# Altium schematic sheet 1_Power and sensors.schdoc
size 307 x 218 mm; Symbol: Sheet-Symbol_A4; Device: Sheet-Symbol_A4; Company: 嘉立创EDA; Drawed: Fukui (Daniel) Yang; Version: V1.0; Page Size: A4; @Project Name: OptoGrid_V0.05; @Page Count: 1; @Update Date: 2025-09-04; @Create Date: 2025-07-05; @Schematic Name: OptoGrid_Battery_V0.05; @Page No: 1; @Page Name: Power and sensors; Title Block Position: 3; Width: 1170; Height: 825; Region Start: 1; X Region Count: 6; Y Region Count: 4; Blade Width: 10; @Board Name: OptoGrid_Battery_V0.05; @Create Time: 17:39:36; @Update Time: 09:45:07
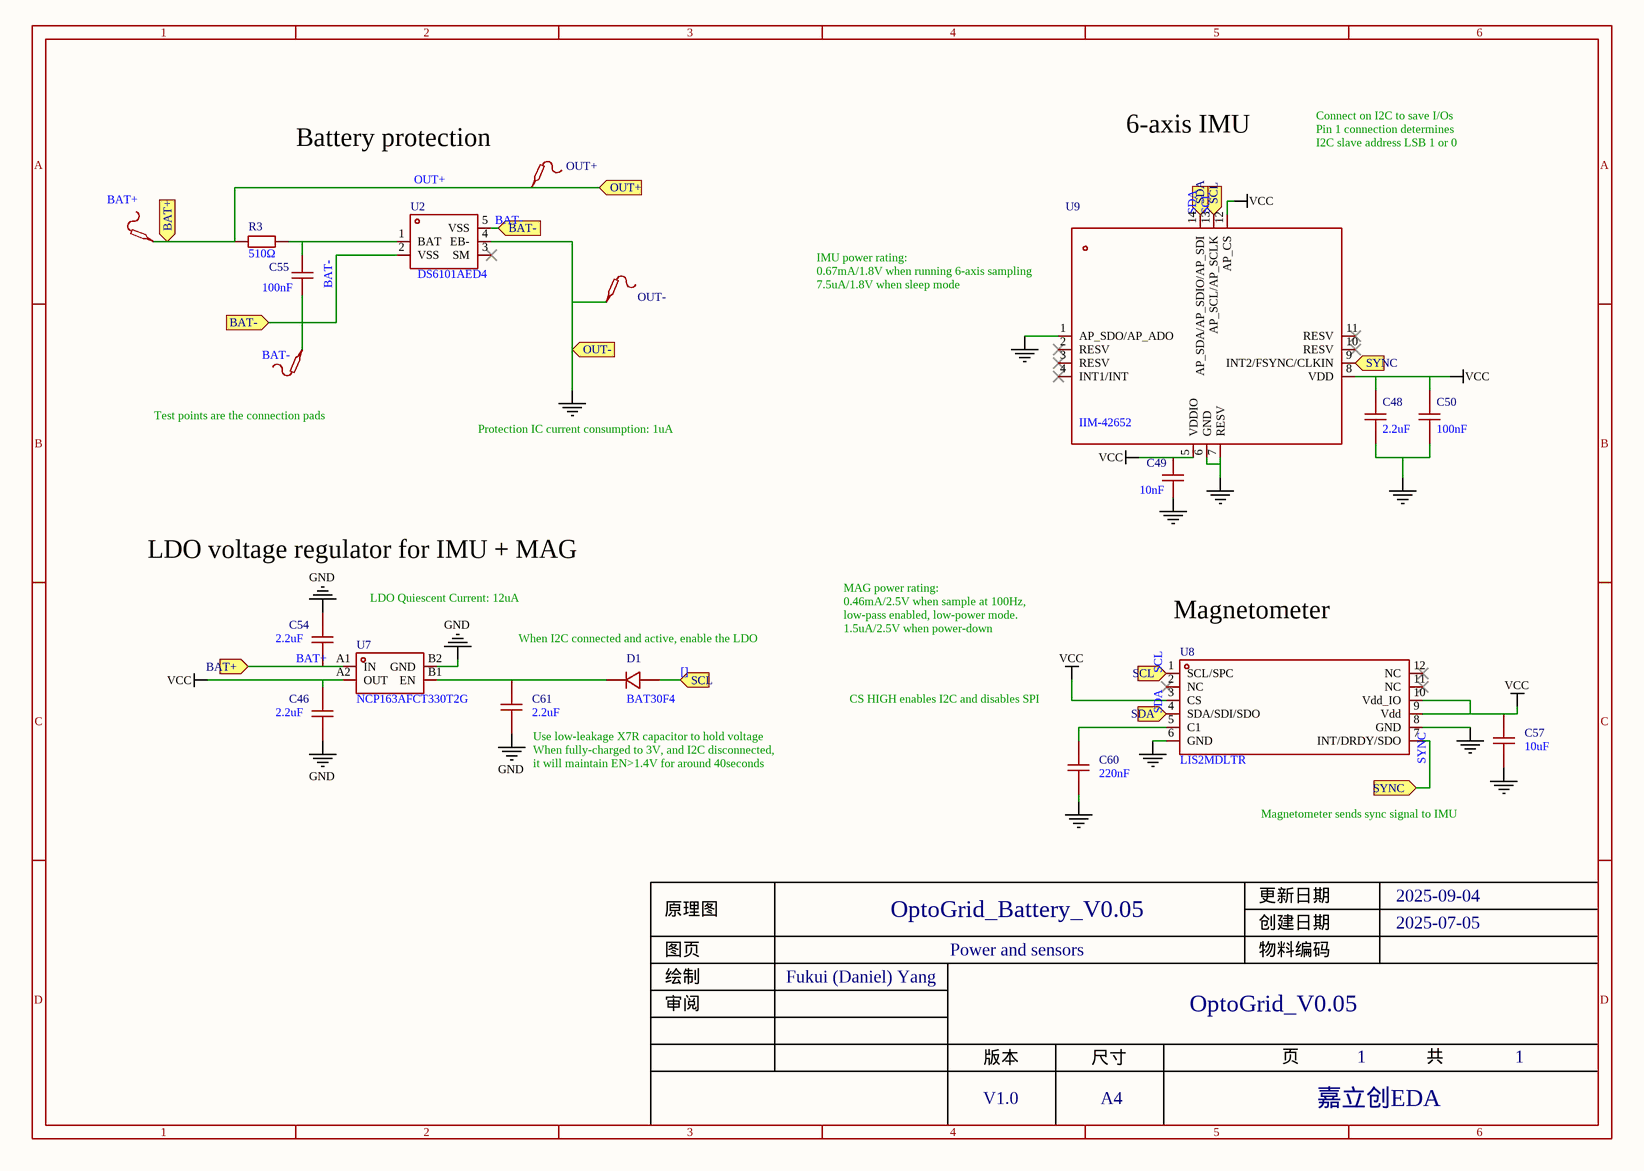
[diagram p0: 1_Power and sensors.schdoc]

## Parts
BAT+  (no value)  [Test-Point-0.5mm]
BAT-  (no value)  [Test-Point-0.5mm]
C46  2.2uF  [C0201]
C48  2.2uF  [C0201]
C49  10nF  [C0201]
C50  100nF  [C0201]
C54  2.2uF  [C0201]
C55  100nF  [C0201]
C57  10uF  [C0402]
C60  220nF  [C0201]
C61  2.2uF  [C0402]
D1  BAT30F4  [DFN0603-D_L0.6-W0.3-P0.34-RD]
OUT+  (no value)  [Test-Point-0.5mm]
OUT-  (no value)  [Test-Point-0.5mm]
R3  510Ω  [R0201]
U2  DS6101AED4  [DFN-4_L1.0-W1.0-P0.65-BL-EP]
U7  NCP163AFCT330T2G  [WLCSP-4_L0.6-W0.6-P0.35-R2-C2-TL]
U8  LIS2MDLTR  [LGA-12_L2.0-W2.0-P0.50-BL]
U9  IIM-42652  [LGA-14_L3.0-W2.5-P0.50-TL]

## Ports
BAT+ (in), BAT- (in), OUT+ (in), OUT- (in), SCL (in), SDA (in), SYNC (in)

## Nets
GND: C46.1 C48.1 C49.1 C50.1 C54.2 C57.1 C60.1 C61.1 OUT-.1 U2.4(EB-) U7.B2(GND) U8.6(GND) U8.8(GND) U9.1(AP_SDO/AP_ADO) U9.6(GND) U9.7(RESV) ; port OUT-
VCC: C46.2 C48.2 C49.2 C50.2 C57.2 U7.A2(OUT) U8.3(CS) U8.9(Vdd) U8.10(Vdd_IO) U9.5(VDDIO) U9.8(VDD) U9.12(AP_CS)
[]: D1.2 U8.1(SCL/SPC) U9.13(AP_SCL/AP_SCLK) ; port SCL  [also labelled SCL]
BAT+: BAT+.1 C54.1 OUT+.1 R3.1 U7.A1(IN) ; port OUT+, port BAT+  [also labelled OUT+]
BAT-: BAT-.1 C55.2 U2.2(VSS) U2.5(VSS) ; port BAT-
SDA: U8.4(SDA/SDI/SDO) U9.14(AP_SDA/AP_SDIO/AP_SDI) ; port SDA
SYNC: U8.7(INT/DRDY/SDO) U9.9(INT2/FSYNC/CLKIN) ; port SYNC
NetC55_1: C55.1 R3.2 U2.1(BAT)
NetC60_2: C60.2 U8.5(C1)
NetC61_2: C61.2 D1.1 U7.B1(EN)

Not connected (* = marked no-connect by the designer): U2 3(SM)*; U8 2(NC)* 11(NC)* 12(NC)*; U9 2(RESV)* 3(RESV)* 4(INT1/INT)* 10(RESV)* 11(RESV)*

## Notes on the sheet
- (near U9) Connect on I2C to save I/Os
  Pin 1 connection determines
  I2C slave address LSB 1 or 0
- (near OUT+) Battery protection
- 6-axis IMU
- IMU power rating:
  0.67mA/1.8V when running 6-axis sampling
  7.5uA/1.8V when sleep mode
- Test points are the connection pads
- Protection IC current consumption: 1uA
- LDO voltage regulator for IMU + MAG
- MAG power rating:
  0.46mA/2.5V when sample at 100Hz,
  low-pass enabled, low-power mode.
  1.5uA/2.5V when power-down
- LDO Quiescent Current: 12uA
- When I2C connected and active, enable the LDO
- (near U8) Magnetometer
- (near C60) CS HIGH enables I2C and disables SPI
- (near C61) Use low-leakage X7R capacitor to hold voltage
  When fully-charged to 3V, and I2C disconnected,
  it will maintain EN>1.4V for around 40seconds
- Magnetometer sends sync signal to IMU
- 1
- 2
- 3
- 4
- 5
- 6
- A
- B
- C
- 原理图
- OptoGrid_Battery_V0.05
- 创建日期
- 更新日期
- 2025-09-04
- 2025-07-05
- 绘制
- 图页
- Fukui (Daniel) Yang
- Power and sensors
- 物料编码
- D
- 审阅
- 版本
- 尺寸
- OptoGrid_V0.05
- 页
- 共
- V1.0
- A4
- 嘉立创EDA

## Library data of the parts
BAT+ BAT- OUT+ OUT- = Test-Point: Add into BOM: yes; Symbol: Test-Point; Device: Test-Point; Convert to PCB: yes
C46 C48 C54 = GRM033R61A225KE47D: Manufacturer: muRata(村田); Add into BOM: yes; Tolerance: ±10%; Voltage Rated: 10V; Temperature Coefficient: X5R; Symbol: GRM033R61A225KE47D; Device: GRM033R61A225KE47D; LCSC Part Name: 2.2uF ±10% 10V; Supplier Part: C335106; Manufacturer Part: GRM033R61A225KE47D; Supplier Footprint: 0201; JLCPCB Part Class: 扩展库; Datasheet: https://atta.szlcsc.com/upload/public/pdf/source/20200305/C490387_23319AE8C154DEB24C505E6C82A8106A.pdf; Supplier: LCSC; Convert to PCB: yes; Value: 2.2uF
C49 = GRM033R71A103KA01D: Manufacturer: muRata(村田); Add into BOM: yes; Tolerance: ±10%; Voltage Rated: 10V; Temperature Coefficient: X7R; Symbol: GRM033R71A103KA01D; Device: GRM033R71A103KA01D; LCSC Part Name: 10nF ±10% 10V; Supplier Part: C76941; Manufacturer Part: GRM033R71A103KA01D; Supplier Footprint: 0201; JLCPCB Part Class: Extended Part; Datasheet: https://atta.szlcsc.com/upload/public/pdf/source/20180307/C76941_15204091038901407729.pdf; Supplier: LCSC; Convert to PCB: yes; Value: 10nF
C50 = GRM033Z71A104KE14D: Manufacturer: muRata(村田); Add into BOM: yes; Tolerance: ±10%; Voltage Rated: 10V; Temperature Coefficient: X7R; Symbol: GRM033Z71A104KE14D; Device: GRM033Z71A104KE14D; LCSC Part Name: 100nF ±10% 10V; Supplier Part: C161494; Manufacturer Part: GRM033Z71A104KE14D; Supplier Footprint: 0201; JLCPCB Part Class: 扩展库; Datasheet: https://atta.szlcsc.com/upload/public/pdf/source/20181119/C161494_7C14CD1E604AF2690E90D16E0278156D.pdf; Supplier: LCSC; Convert to PCB: yes; Value: 100nF
C55 = GRM033R61E104KE14D: Manufacturer: muRata(村田); Add into BOM: yes; Tolerance: ±10%; Voltage Rated: 25V; Temperature Coefficient: X5R; Symbol: GRM033R61E104KE14D; Device: GRM033R61E104KE14D; LCSC Part Name: 100nF ±10% 25V; Supplier Part: C76939; Manufacturer Part: GRM033R61E104KE14D; Supplier Footprint: 0201; JLCPCB Part Class: Extended Part; Datasheet: https://atta.szlcsc.com/upload/public/pdf/source/20180307/C76939_15204091018551407727.pdf; Supplier: LCSC; Convert to PCB: yes; Value: 100nF
C57 = CL05A106MP5NUNC: Manufacturer: SAMSUNG(三星); Symbol: CL05A106MP5NUNC_C315248; Add into BOM: yes; Tolerance: ±20%; Voltage Rated: 10V; Temperature Coefficient: X5R; Device: CL05A106MP5NUNC; LCSC Part Name: 10uF ±20% 10V; Supplier Part: C315248; Manufacturer Part: CL05A106MP5NUNC; Supplier Footprint: 0402; JLCPCB Part Class: 扩展库; Datasheet: https://atta.szlcsc.com/upload/public/pdf/source/20231220/1EF805BAE1520675928CC4638D279E74.pdf; Supplier: LCSC; Convert to PCB: yes; Value: 10uF
C60 = GRM033R61E224KE01D: Manufacturer: muRata(村田); Add into BOM: yes; Tolerance: ±10%; Voltage Rated: 25V; Temperature Coefficient: X5R; Symbol: GRM033R61E224KE01D; Device: GRM033R61E224KE01D; LCSC Part Name: 220nF ±10% 25V; Supplier Part: C701263; Manufacturer Part: GRM033R61E224KE01D; Supplier Footprint: 0201; JLCPCB Part Class: Extended Part; Datasheet: https://atta.szlcsc.com/upload/public/pdf/source/20200407/C503309_0211D99E6F86B2657E389DD3F8367252.pdf; Supplier: LCSC; Convert to PCB: yes; Value: 220nF
C61 = GRM155Z71A225KE01D: Manufacturer: muRata(村田); Add into BOM: yes; Tolerance: ±10%; Voltage Rated: 10V; Temperature Coefficient: X7R; Symbol: GRM155Z71A225KE01D; Device: GRM155Z71A225KE01D; LCSC Part Name: 2.2uF ±10% 10V; Supplier Part: C2997286; Manufacturer Part: GRM155Z71A225KE01D; Supplier Footprint: 0402; JLCPCB Part Class: 扩展库; Datasheet: https://atta.szlcsc.com/upload/public/pdf/source/20220829/B8FE0067CE648DEA50203A5BE382F6B9.pdf; Supplier: LCSC; Convert to PCB: yes; Value: 2.2uF
D1 = BAT30F4: Manufacturer: ST(意法半导体); Add into BOM: yes; Forward Voltage (Vf@If): 625mV@300mA; Reverse Voltage (Vr): 30V; Average Rectified Current (Io): 300mA; Reverse Leakage Current (Ir): 50uA@30V; Symbol: BAT30F4; Device: BAT30F4; LCSC Part Name: 电压:30V 电流:300mA; Supplier Part: C314018; Manufacturer Part: BAT30F4; Supplier Footprint: 0201; JLCPCB Part Class: 扩展库; Datasheet: https://atta.szlcsc.com/upload/public/pdf/source/20181210/C314018_50BFE9E29FED27C39CE5C54F1586C636.pdf; Supplier: LCSC; Convert to PCB: yes
R3 = RC0201FR-07510RL: Manufacturer: YAGEO(国巨); Add into BOM: yes; Tolerance: ±1%; Power(Watts): 50mW; Overload Voltage (Max): 25V; Temperature Coefficient: ±200ppm/℃; Symbol: RC0201FR-07510RL; Device: RC0201FR-07510RL; LCSC Part Name: 厚膜电阻 510Ω ±1% 50mW; Supplier Part: C57784; Manufacturer Part: RC0201FR-07510RL; Supplier Footprint: 0201; JLCPCB Part Class: Extended Part; Datasheet: https://atta.szlcsc.com/upload/public/pdf/source/20181009/C309620_DA5935B6E1D48212CB7A533FE518B3C2.pdf; Supplier: LCSC; Convert to PCB: yes; Type: 厚膜电阻; Value: 510Ω; Operating Temperature Range: -55℃~+125℃
U2 = DS6101AED4: Manufacturer: DSTECH(奥简科技); Add into BOM: yes; Symbol: DS6101AED4; Device: DS6101AED4; LCSC Part Name: 锂电池保护芯片; Supplier Part: C7499469; Manufacturer Part: DS6101AED4; Supplier Footprint: DFN-4L(1x1); JLCPCB Part Class: Extended Part; Datasheet: https://atta.szlcsc.com/upload/public/pdf/source/20231201/DEF2DD3321564EEF592C272488CBF649.pdf; Supplier: LCSC; Convert to PCB: yes
U7 = NCP163AFCT330T2G: Manufacturer: onsemi(安森美); Add into BOM: yes; Symbol: NCP163AFCT330T2G; Device: NCP163AFCT330T2G; LCSC Part Name: LDO 稳压器，250 mA，超高 PSRR，超低噪音; Supplier Part: C603648; Manufacturer Part: NCP163AFCT330T2G; Supplier Footprint: WLCSP-4; JLCPCB Part Class: 扩展库; Datasheet: https://atta.szlcsc.com/upload/public/pdf/source/20200927/C603657_74821F5CD7CAE943477E5F5DC4975E14.pdf; Supplier: LCSC; Convert to PCB: yes; Output Type: -
U8 = LIS2MDLTR: Manufacturer: ST(意法半导体); Add into BOM: yes; Symbol: LIS2MDLTR; Device: LIS2MDLTR; LCSC Part Name: 霍尔效应开关; Supplier Part: C919695; Manufacturer Part: LIS2MDLTR; Supplier Footprint: LGA-12(2x2); JLCPCB Part Class: 扩展库; Datasheet: https://atta.szlcsc.com/upload/public/pdf/source/20211119/145E3A73C2A09E2C981D93C27CF540FA.pdf; Supplier: LCSC; Convert to PCB: yes
U9 = IIM-42652: Manufacturer: TDK InvenSense(应美盛); Add into BOM: yes; Axial Direction: X,Y,Z; Supply Voltage: 1.71V~3.6V; Symbol: IIM-42652; Device: IIM-42652; LCSC Part Name: 传感器; Supplier Part: C2988404; Manufacturer Part: IIM-42652; Supplier Footprint: LGA-14(2.5x3); JLCPCB Part Class: 扩展库; Supplier: LCSC; Convert to PCB: yes; Operating Temperature: -40℃~+105℃